# EAGLE design bq24616_battery_charger (EAGLE 9.5.2)
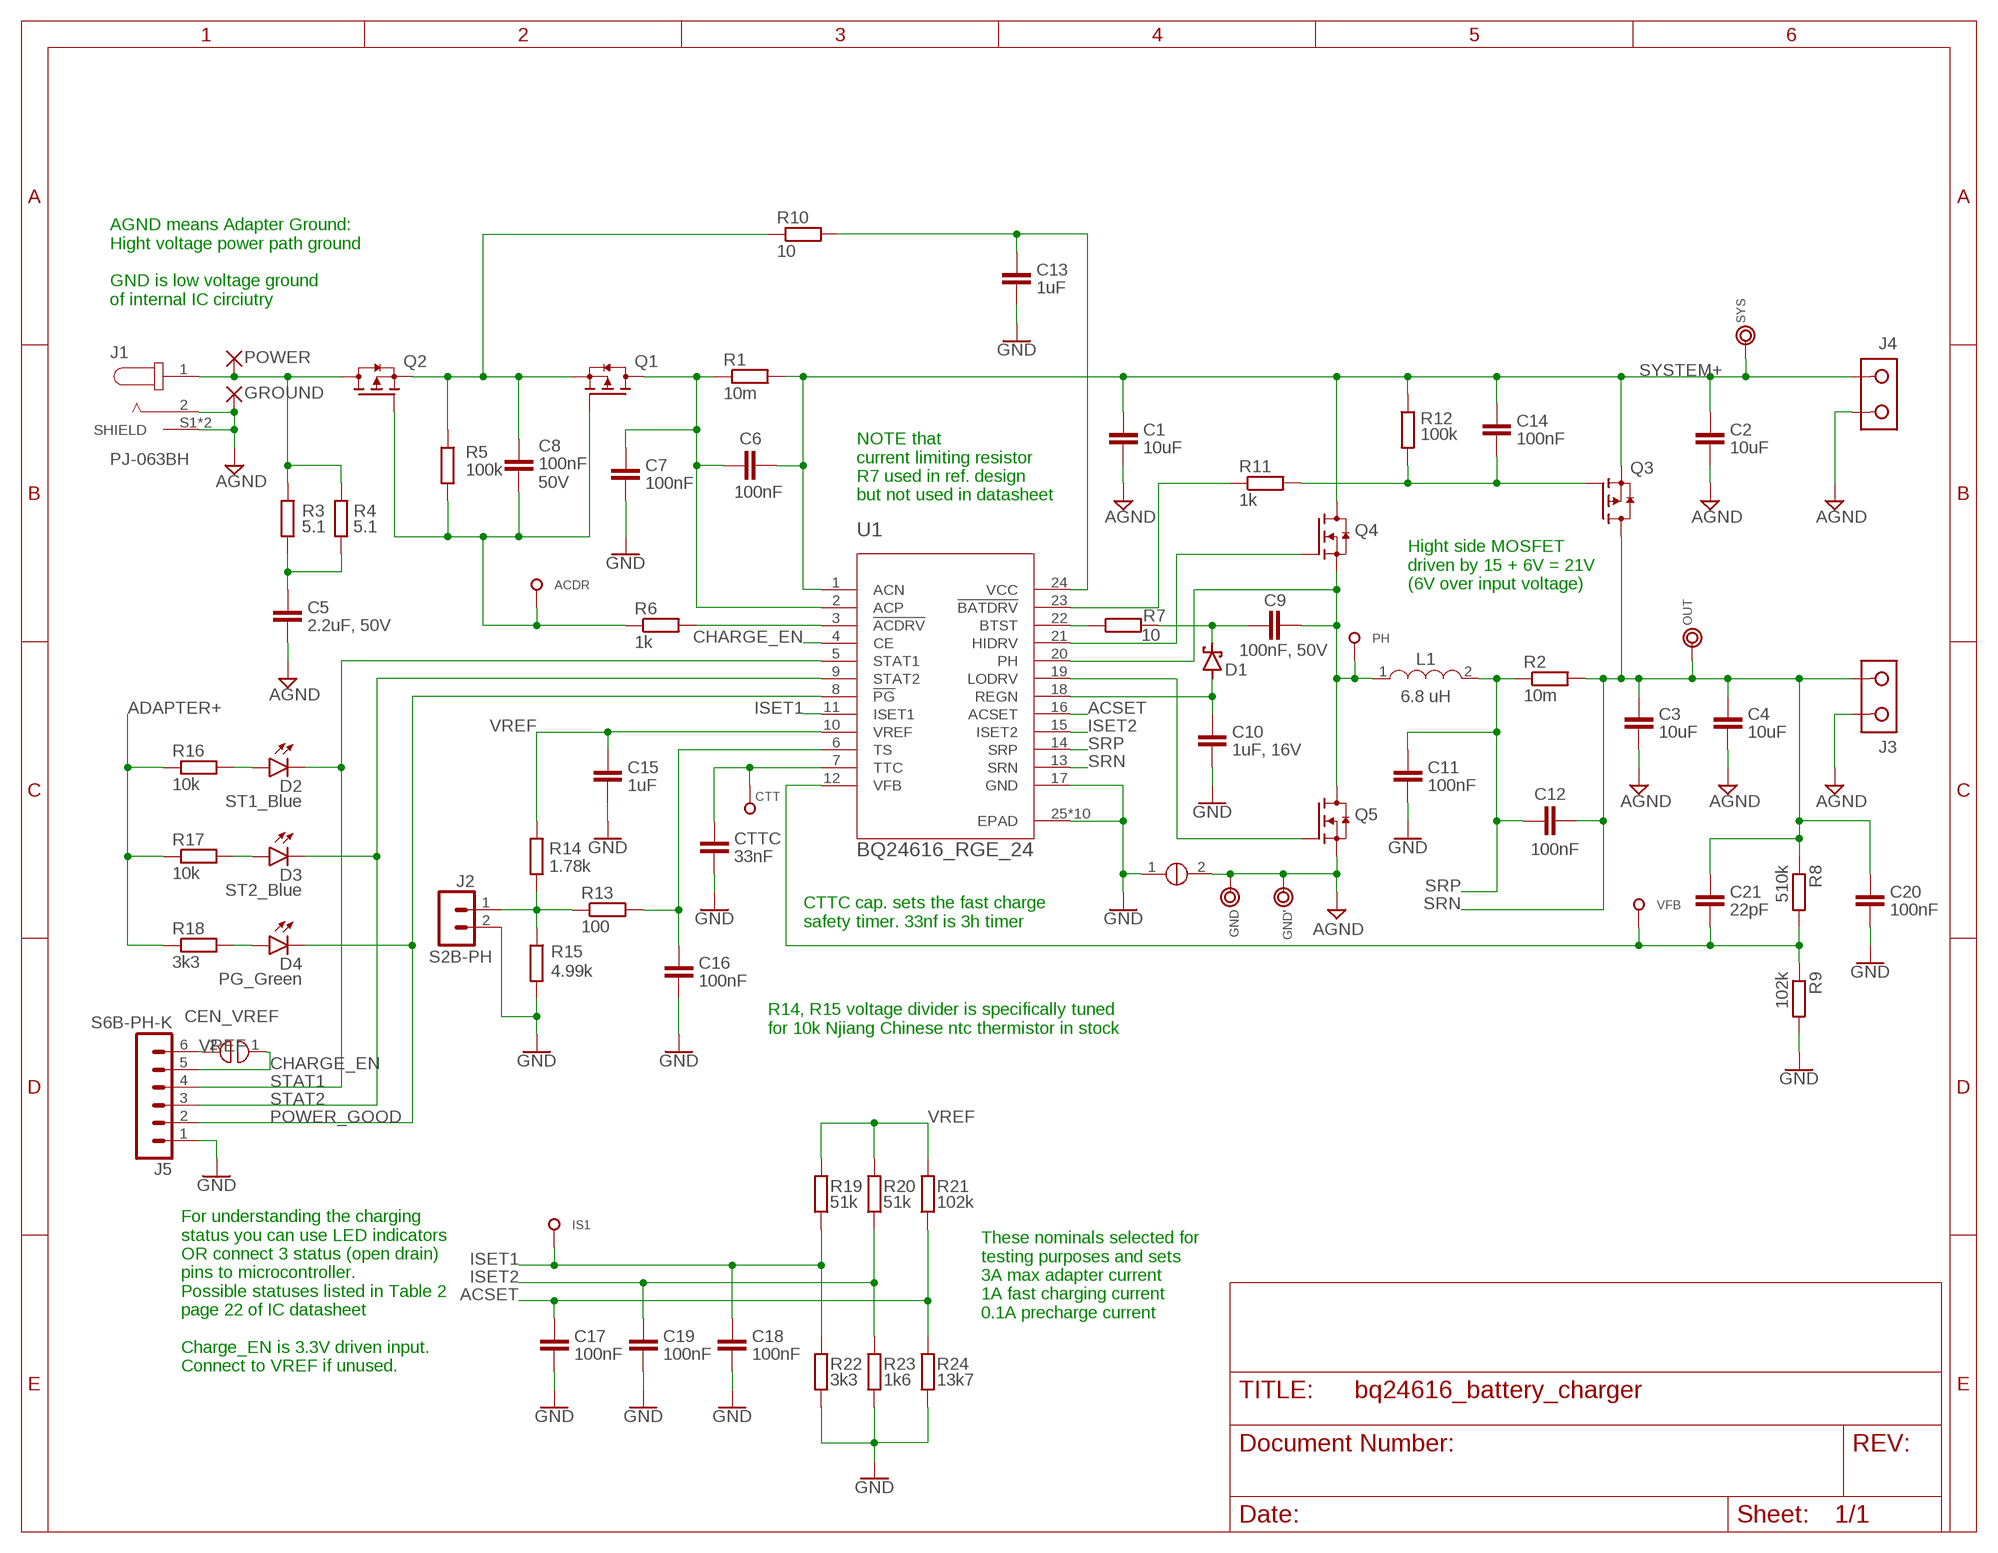
[diagram p0: schematic, sheet 1]

## Parts
ACDR  TEST_PAD-[1.27MM]  [TP1.27MM]
C1  10uF  C-EU-CERAMIC1206  [C1206]
C2  10uF  C-EU-CERAMIC1206  [C1206]
C3  10uF  C-EU-CERAMIC1206  [C1206]
C4  10uF  C-EU-CERAMIC1206  [C1206]
C5  2.2uF, 50V  C-EU-CERAMIC0805  [C0805]
C6  100nF  C-EU-CERAMIC0603  [C0603]
C7  100nF  C-EU-CERAMIC0603  [C0603]
C8  100nF  C-EU-CERAMIC0603  [C0603]
C9  100nF, 50V  C-EU-CERAMIC0603  [C0603]
C10  1uF, 16V  C-EU-CERAMIC0603  [C0603]
C11  100nF  C-EU-CERAMIC0603  [C0603]
C12  100nF  C-EU-CERAMIC0603  [C0603]
C13  1uF  C-EU-CERAMIC0603  [C0603]
C14  100nF  C-EU-CERAMIC0603  [C0603]
C15  1uF  C-EU-CERAMIC0603  [C0603]
C16  100nF  C-EU-CERAMIC0603  [C0603]
C17  100nF  C-EU-CERAMIC0603  [C0603]
C18  100nF  C-EU-CERAMIC0603  [C0603]
C19  100nF  C-EU-CERAMIC0603  [C0603]
C20  100nF  C-EU-CERAMIC0603  [C0603]
C21  22pF  C-EU-CERAMIC0603  [C0603]
CEN_VREF  SOLDER_BRIDGE  [SOLDER_BRIDGE]
CTT  TEST_PAD-[1.27MM]  [TP1.27MM]
CTTC  33nF  C-EU-CERAMIC0603  [C0603]
D1  SOD523-SCHOTTKY  [SOD523]
D2  ST1_Blue  LED0805  [LED-0805]
D3  ST2_Blue  LED0805  [LED-0805]
D4  PG_Green  LED0805  [LED-0805]
GND  TEST_RING  [TEST_RING]
GND'  TEST_RING  [TEST_RING]
GROUND  WIRE_TO_BOARD_2,54/1,1  [2,54/1,1]
IS1  TEST_PAD-[1.27MM]  [TP1.27MM]
J1  PJ-063BH  [CUI_PJ-063BH]
J2  S2B-PH  S2B-PH-K  [S2B-PH-K]
J3  DG301-2P"  [DG301-2P]
J4  DG301-2P"  [DG301-2P]
J5  S6B-PH-K  [S6B-PH-K]
L1  6.8 uH  MCS0630-100MN1  [SMD-0630]
OUT  TEST_RING  [TEST_RING]
PH  TEST_PAD-[1.27MM]  [TP1.27MM]
POWER  WIRE_TO_BOARD_2,54/1,1  [2,54/1,1]
Q1  SI7121DN-T1-GE3  [VISHAY_SI7121DN-T1-GE3]
Q2  SI7121DN-T1-GE3  [VISHAY_SI7121DN-T1-GE3]
Q3  SI7121DN-T1-GE3  [VISHAY_SI7121DN-T1-GE3]
Q4  SON5X6_MOSFET  [SON5X6]
Q5  SON5X6_MOSFET  [SON5X6]
R1  10m  R_EU_CS  [CS_R0805]
R2  10m  R_EU_CS  [CS_R0805]
R3  5.1  R-EU1206  [R1206]
R4  5.1  R-EU1206  [R1206]
R5  100k  R-EU0603  [R0603]
R6  1k  R-EU0603  [R0603]
R7  10  R-EU0603  [R0603]
R8  510k  R-EU0603  [R0603]
R9  102k  R-EU0603  [R0603]
R10  10  R-EU1206  [R1206]
R11  1k  R-EU0603  [R0603]
R12  100k  R-EU0603  [R0603]
R13  100  R-EU0603  [R0603]
R14  1.78k  R-EU0603  [R0603]
R15  4.99k  R-EU0603  [R0603]
R16  10k  R-EU0603  [R0603]
R17  10k  R-EU0603  [R0603]
R18  3k3  R-EU0603  [R0603]
R19  51k  R-EU0603  [R0603]
R20  51k  R-EU0603  [R0603]
R21  102k  R-EU0603  [R0603]
R22  3k3  R-EU0603  [R0603]
R23  1k6  R-EU0603  [R0603]
R24  13k7  R-EU0603  [R0603]
SB2  SHORT  [SHORT]
SYS  TEST_RING  [TEST_RING]
U1  BQ24616_RGE_24  [RGE24_2P45X2P45]
VFB  TEST_PAD-[1.27MM]  [TP1.27MM]

## Nets
ACDRV: R6.2 U1.3(!ACDRV)
ACP: C6.1 C7.1 Q1.5(D) Q1.6(D) Q1.7(D) Q1.8(D) Q1.9(D) R1.1 U1.2(ACP)
ACSET: C17.1 R21.1 R24.2 U1.16(ACSET)
ADAPTER+: J1.1 POWER.1(P) Q2.5(D) Q2.6(D) Q2.7(D) Q2.8(D) Q2.9(D) R3.2 R4.2 R16.1 R17.1 R18.1
AGND: C1.2 C2.2 C3.2 C4.2 C5.2 GND'.1 GND.1 GROUND.1(P) J1.2 J1.S1(SHIELD) J1.S2(SHIELD) J3.1 J4.2 Q5.1(S) Q5.2(S) Q5.3(S) SB2.2
BATDRV: R11.1 U1.23(!BATDRV)
BTST: R7.1 U1.22(BTST)
BTST1: C9.1 D1.C R7.2
CHARGE_EN: CEN_VREF.1 J5.5 U1.4(CE)
GATE: ACDR.1 C8.2 Q1.4(G) Q2.4(G) R5.2 R6.1
GND: C7.2 C10.2 C11.2 C13.2 C15.2 C16.2 C17.2 C18.2 C19.2 C20.2 CTTC.2 J2.2 J5.1 R9.2 R15.2 R22.1 R23.1 R24.1 SB2.1 U1.17(GND) U1.25(EPAD) U1.V(EPAD) U1.V_1(EPAD) U1.V_2(EPAD) U1.V_3(EPAD) U1.V_4(EPAD) U1.V_5(EPAD) U1.V_6(EPAD) U1.V_7(EPAD) U1.V_8(EPAD)
HIDRV: Q4.4(G) U1.21(HIDRV)
ISET1: C18.1 IS1.1 R19.1 R22.2 U1.11(ISET1)
ISET2: C19.1 R20.1 R23.2 U1.15(ISET2)
LODRV: Q5.4(G) U1.19(LODRV)
N$3: C5.1 R3.1 R4.1
N$17: C14.2 Q3.4(G) R11.2 R12.2
N$22: J2.1 R13.1 R14.2 R15.1
N$25: D2.+(A) R16.2
N$26: D3.+(A) R17.2
N$27: D4.+(A) R18.2
PH: C9.2 L1.1 PH.1 Q4.1(S) Q4.2(S) Q4.3(S) Q5.5(D) Q5.6(D) Q5.7(D) Q5.8(D) Q5.9(D) U1.20(PH)
POWER_GOOD: D4.-(C) J5.2 U1.8(!PG)
REGN: C10.1 D1.A U1.18(REGN)
SRN: C3.1 C4.1 C12.2 C20.1 C21.1 J3.2 OUT.1 Q3.5(D) Q3.6(D) Q3.7(D) Q3.8(D) Q3.9(D) R2.2 R8.1 U1.13(SRN)
SRP: C11.1 C12.1 L1.2 R2.1 U1.14(SRP)
STAT1: D2.-(C) J5.4 U1.5(STAT1)
STAT2: D3.-(C) J5.3 U1.9(STAT2)
SYSTEM+: C1.1 C2.1 C6.2 C14.1 J4.1 Q3.1(S) Q3.2(S) Q3.3(S) Q4.5(D) Q4.6(D) Q4.7(D) Q4.8(D) Q4.9(D) R1.2 R12.1 SYS.1 U1.1(ACN)
TCC: CTT.1 CTTC.1 U1.7(TTC)
TS: C16.1 R13.2 U1.6(TS)
VCC: C13.1 R10.2 U1.24(VCC)
VCC1: C8.1 Q1.1(S) Q1.2(S) Q1.3(S) Q2.1(S) Q2.2(S) Q2.3(S) R5.1 R10.1
VFB: C21.2 R8.2 R9.1 U1.12(VFB) VFB.1
VREF: C15.1 CEN_VREF.2 J5.6 R14.1 R19.2 R20.2 R21.2 U1.10(VREF)

## Notes on the sheet
- AGND means Adapter Ground:
  Hight voltage power path ground
  
  GND is low voltage ground
  of internal IC circiutry
- 50V
- NOTE that 
  current limiting resistor
  R7 used in ref. design
  but not used in datasheet
- Hight side MOSFET
  driven by 15 + 6V = 21V
  (6V over input voltage)
- CTTC cap. sets the fast charge
  safety timer. 33nf is 3h timer
- R14, R15 voltage divider is specifically tuned
  for 10k Njiang Chinese ntc thermistor in stock
- These nominals selected for
  testing purposes and sets
  3A max adapter current
  1A fast charging current
  0.1A precharge current
- For understanding the charging
  status you can use LED indicators
  OR connect 3 status (open drain)
  pins to microcontroller.
  Possible statuses listed in Table 2
  page 22 of IC datasheet
  
  Charge_EN is 3.3V driven input.
  Connect to VREF if unused.

## Library data of the parts
ACDR CTT IS1 PH VFB = testing:TEST_PAD: Test point SMD Updated: 05.11.19 by Andrey Dovnar, andrevdovnar@gmail.com
C1-C21 CTTC = Capacitors:C-EU-CERAMIC
CEN_VREF = testing:SOLDER_BRIDGE
D1 = Semiconductor_devices:SOD523-SCHOTTKY
D2-D4 = Semiconductor_devices:LED0805: LED Model suitable for all 0805 leds Updated: 22.10.19 by Andrey Dovnar, andrevdovnar@gmail.com
GND GND' OUT SYS = testing:TEST_RING: Test rings are used to fixing multimeter probe and doing measurements hands-free Updated: 02.01.2020 by Denis Yaskevich, denis.jaskevich@yandex.by
GROUND POWER = commonly used connectors:WIRE_TO_BOARD_2,54/1,1: THROUGH-HOLE PAD
J1 = commonly used connectors:PJ-063BH: 2.5 mm Center Pin, 8.0 A, Right Angle, Through Hole, Shielded, Kinked Pins, Dc Power Jack Connector; MANUFACTURER: CUI INC; PARTREV: 1.02; STANDARD: Manufacturer recommendations
J2 = con-jst-ph:S2B-PH-K: Wire to board connector Model suitable for S2B-PH-K Updated: 21.10.19 by Andrey Dovnar, andrevdovnar@gmail.com
J3 J4 = Terminal blocks:DG301-2P
J5 = con-jst-ph:S6B-PH-K: Wire to board connector Model suitable for S6B-PH-K Updated: 21.10.19 by Andrey Dovnar, andrevdovnar@gmail.com
L1 = Inductors:MCS0630-100MN1: Inductors (SMD) 0630,SMD,7.3x6.6mm RoHS Source: Datasheet <https://datasheet.lcsc.com/szlcsc/1912111437_PSA-Prosperity-Dielectrics-MCS0630-100MN1_C385254.pdf>
Q1-Q3 = Transistors:SI7121DN-T1-GE3: P Channel 30V 0.018 Ohm 52 W Surface Mount Power Mosfet - PowerPAK-1212-8; DESCRIPTION: P-Channel 30V 16A _Tc_ Surface Mount PowerPAK® 1212-8; LCSC_PART_NUMBER: C190356; LCSC_PURCHASE_URL: https://lcsc.com/product-detail/MOSFET_Vishay-Intertech_SI7121DN-T1-GE3_Vishay-Intertech-SI7121DN-T1-GE3_C190356.html; MF: Vishay Siliconix; MPN: SI7121DN-T1-GE3; PACKAGE: PowerPAK®-1212-8 Vishay
Q4 Q5 = Transistors:SON5X6_MOSFET: Suitable for TI csd185**Q5A MOSFETs; BUILT_BY: EMA_UL_Team; MANUFACTURER_PART_NUMBER: CSD18534Q5A; VENDOR: Texas Instruments
R1 R2 = Resistors:R_EU_CS
R3-R24 = Resistors:R-EU
SB2 = testing:SHORT
U1 = Impulse dc-dc:BQ24616_RGE_24: JEITA Compatible Stand-Alone Synchronous Switch-Mode Li-Ion or Li-Polymer Battery Charger; DATASHEET_URL: http://www.ti.com/lit/gpn/BQ24616; DESCRIPTION: JEITA Compatible Stand-Alone Synchronous Switch-Mode Li-Ion or Li-Polymer Battery Charger; FAMILY_NAME: BATTERY CHARGE MANAGEMENT; GENERIC_PART_NUMBER: BQ24616; INDUSTRY_STD_PKG_TYPE: VQFN; MANUFACTURER: Texas Instruments; PACKAGE_DESIGNATOR: RGE; PIN_COUNT: 24

## Board
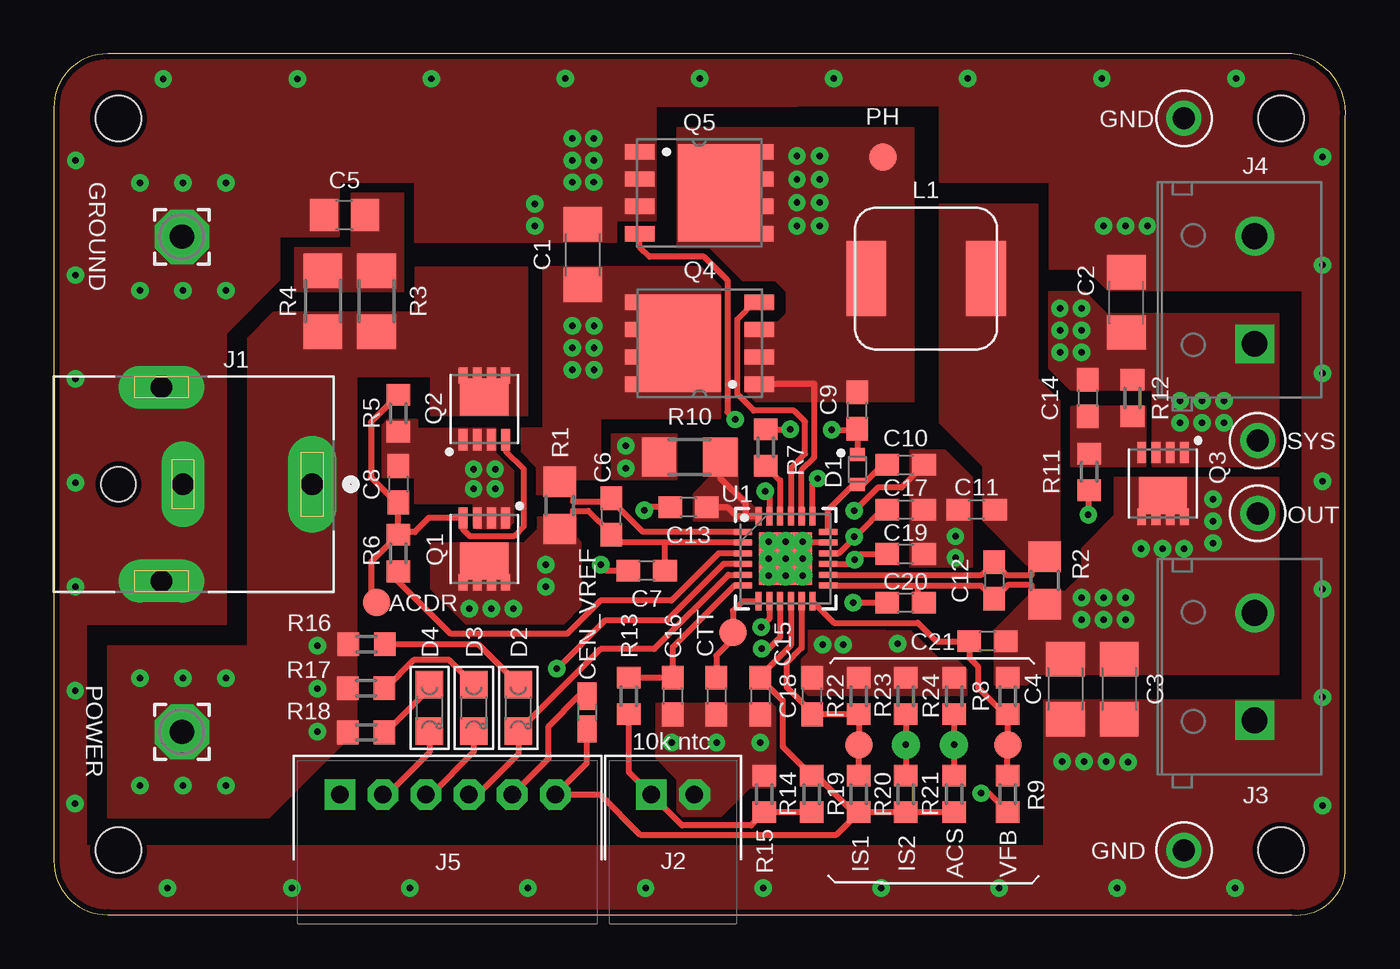
[diagram p1: board, top side]
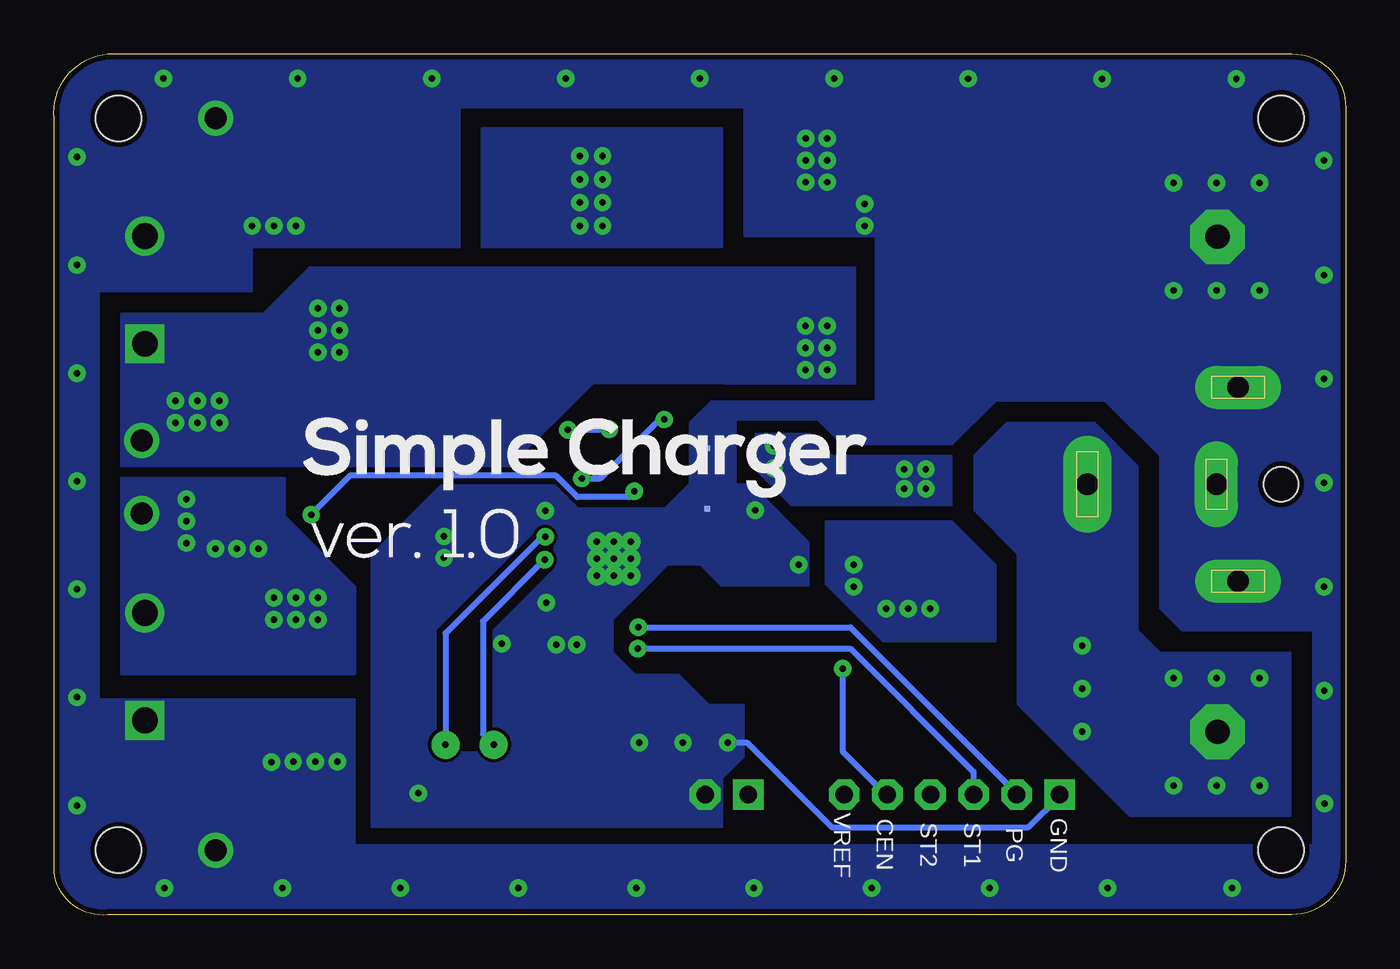
[diagram p2: board, bottom side, seen from below]

Size 60.01 x 40.01 mm. Coordinates in mm from the lower left corner, seen from the top.
Outline: 0,37.51 0,2.51 arc90 2.5,0.01 57.5,0.01 arc90 60,2.01 60,37.01 arc90 57.5,40.01 2.5,40.01 arc90 0,37.51
Copper layers (1*16): Top 0.035mm / dielectric 0.11mm / Bottom 0.035mm
Design rules "Design_rules_charger *": minimum track width 6mil, minimum drill 0.3mm, track to track 6mil, track to pad 6mil, pad to pad 6mil, via to via 6mil, smd to smd 6mil, copper to edge 10mil, drill to drill 8mil, minimum pad ring 12mil, minimum via ring 10mil, stop-mask expansion 3mil, vias tented up to drill 25mil, thermal gap 10mil
Holes 2.1 mm at 3,37.01 3,3.01 57,37.01 57,3.01

### Footprints (pad centres in the part's own frame; a part is rotated, then mirrored left to right if it is on the bottom)
TP1.27MM = smd 1.27 x 1.27: 1 0,0
C1206 = smd 1.6 x 1.8: 1 -1.4,0; 2 1.4,0
C0805 = smd 1.3 x 1.5: 1 -0.95,0; 2 0.95,0
C0603 = smd 1.1 x 1: 1 -0.85,0; 2 0.85,0
SOLDER_BRIDGE = smd 1.27 x 0.889: 1 -0.762,0; 2 0.762,0
SOD523 = smd 0.6 x 0.7: A 0.7,0; C -0.7,0
LED-0805 = smd 1.27 x 1.27: + -1.079,0; - 1.079,0
TEST_RING = drill 1.02 pad 1.6: 1 0,0
2,54/1,1 = drill 1.118 pad 2.54 octagon: 1 0,0
CUI_PJ-063BH = drill 1 pad 2.25 long: 1 0,0 | drill 1 pad 2 long: 2 6,0; S1 7,4.5; S2 7,-4.5 | hole 1.6: 9,0
S2B-PH-K = drill 0.813 square: 1 -1,0 | drill 0.813 octagon: 2 1,0
DG301-2P = drill 1.2 square: 1 -2.5,0 | drill 1.2: 2 2.5,0
S6B-PH-K = drill 0.813 square: 1 -5,0 | drill 0.813 octagon: 2 -3,0; 3 -1,0; 4 1,0; 5 3,0; 6 5,0
SMD-0630 = smd 1.85 x 3.5: 1 -2.775,0; 2 2.775,0
VISHAY_SI7121DN-T1-GE3 = smd 0.991 x 0.406: 1 -1.435,0.99; 2 -1.435,0.33; 3 -1.435,-0.33; 4 -1.435,-0.99 | smd 0.762 x 0.406: 5 1.55,-0.99; 6 1.55,-0.33; 7 1.55,0.33; 8 1.55,0.99 | smd 1.727 x 2.235: 9 0.557,0
SON5X6 = smd 1.372 x 0.71: 1 -2.77,1.905; 2 -2.77,0.635; 3 -2.77,-0.635; 4 -2.77,-1.905 | smd 1.18 x 0.71: 5 2.866,-1.905; 6 2.866,-0.635; 7 2.866,0.635; 8 2.866,1.905 | smd 3.85 x 4.52: 9 0.941,0
CS_R0805 = smd 1.4 x 1.5: 1 -1.1,0; 2 1.1,0
R1206 = smd 1.6 x 1.803: 1 -1.422,0; 2 1.422,0
R0603 = smd 1 x 1.1: 1 -0.85,0; 2 0.85,0
SHORT = smd 0.254 x 0.254: 1 -1.397,0; 2 1.397,0
RGE24_2P45X2P45 = smd 0.85 x 0.28: 1 -1.975,1.25; 2 -1.975,0.75; 3 -1.975,0.25; 4 -1.975,-0.25; 5 -1.975,-0.75; 6 -1.975,-1.25; 13 1.975,-1.25; 14 1.975,-0.75; 15 1.975,-0.25; 16 1.975,0.25; 17 1.975,0.75; 18 1.975,1.25 | smd 0.28 x 0.85: 7 -1.25,-1.975; 8 -0.75,-1.975; 9 -0.25,-1.975; 10 0.25,-1.975; 11 0.75,-1.975; 12 1.25,-1.975; 19 1.25,1.975; 20 0.75,1.975; 21 0.25,1.975; 22 -0.25,1.975; 23 -0.75,1.975; 24 -1.25,1.975 | smd 2.45 x 2.45: 25 0,0 | drill 0.3 pad 0.508: V -0.787,-0.787; V_1 -0.787,0; V_2 -0.787,0.787; V_3 0,-0.787; V_4 0,0; V_5 0,0.787; V_6 0.787,-0.787; V_7 0.787,0; V_8 0.787,0.787

### Placement (x,y rotation side)
ACDR  15,14.53 0 top
C1  24.58,30.68 90 top
C2  49.82,28.46 90 top
C3  49.48,10.5 270 top
C4  46.98,10.5 270 top
C5  13.5,32.51 180 top
C6  25.9,18.52 90 top
C7  27.54,16 180 top
C8  16,20.01 270 top
C9  37.33,23.44 90 top
C10  39.57,20.91 0 top
C11  42.86,18.84 180 top
C12  43.67,15.55 270 top
C13  29.48,18.95 180 top
C14  48.02,24.02 270 top
C15  32.81,10.17 270 top
C16  28.74,10.17 270 top
C17  39.57,18.84 0 top
C18  35.24,10.17 90 top
C19  39.57,16.78 0 top
C20  39.57,14.5 180 top
C21  43.37,12.73 180 top
CEN_VREF  24.77,9.41 270 top
CTT  31.55,13.13 0 top
CTTC  30.78,10.17 270 top
D1  37.33,20.7 270 top
D2  21.58,9.63 270 top
D3  19.51,9.63 270 top
D4  17.45,9.63 270 top
GND  52.5,3.01 0 top
GND'  52.5,37.01 0 top
GROUND  5.95,31.51 0 top
IS1  37.39,7.91 0 top
J1  12,20.01 180 top
J2  28.76,5.59 0 top
J3  55.78,11.54 90 top
J4  55.78,29.04 90 top
J5  18.29,5.59 0 top
L1  40.52,29.57 0 top
OUT  55.92,18.67 0 top
PH  38.51,35.22 0 top
POWER  5.95,8.51 0 top
Q1  20,17.01 270 top
Q2  20,23.51 90 top
Q3  51.52,20.05 270 top
Q4  30,26.56 180 top
Q5  29.98,33.55 0 top
R1  23.5,19.03 90 top
R2  46.02,15.55 270 top
R3  15,28.51 270 top
R4  12.5,28.51 270 top
R5  16,23.31 90 top
R6  16,16.81 270 top
R7  33.07,21.72 90 top
R8  44.3,10.17 270 top
R9  44.3,5.63 270 top
R10  29.53,21.28 0 top
R11  48.09,20.59 90 top
R12  50.1,24.02 270 top
R13  26.71,10.17 90 top
R14  35.21,5.63 270 top
R15  33,5.63 90 top
R16  14.53,12.59 0 top
R17  14.51,10.54 0 top
R18  14.51,8.49 0 top
R19  37.39,5.63 270 top
R20  39.57,5.63 270 top
R21  41.83,5.63 270 top
R22  37.39,10.17 270 top
R23  39.57,10.17 270 top
R24  41.83,10.17 270 top
SB2  29.67,20.28 90 bottom
SYS  55.92,22.05 0 top
U1  33.99,16.55 0 top
VFB  44.33,7.91 0 top

### Tracks (layer width: path | path; a pad name or v marks a point on that pad's centre or on a via)
ACDRV
  Top 0.279: U1.3 30.88,16.8 28.69,14.61 25.39,14.61 23.85,13.07 18.44,13.07 16,15.51 R6.2
ACP  (via drill 0.3)
  Top 0.279: R1.1 23.65,17.93 24.1,18.38 24.1,18.78 24.84,18.78 25.9,17.72 C6.1 26.27,17.3 28.39,17.3 | C7.1 28.39,17.3 | U1.2 28.39,17.3
  other vias: 19.3,14.24 20.32,14.24 21.34,14.24 22.86,15.25 22.86,16.27
  pour Top (no thermals): 24.5,17.31 24.5,14.35 23.67,13.52 19.16,13.52 17.5,15.18 17.5,17.31 21.84,17.29 22.48,17.92 22.48,18.5 24.26,18.5 24.25,17.56
  pour Bottom (no thermals): 18.29,18.3 24.16,18.3 24.16,15.38 21.49,12.71 16.26,12.71 16.26,16.27
ACSET  (via drill 0.3, 0.3 pad 1.3)
  Top 0.279: U1.16 36.47,16.8 37.19,17.52 v37.19,17.57 37.24,17.57 37.47,17.8 38.5,18.84 C17.1 | R21.1 41.83,8.14 | 41.83,8.14 R24.2 | 41.83,8.14 41.82,8.13 v41.82,7.91
  Bottom 0.279: v41.82,7.91 41.82,13.09 37.33,17.57 v37.19,17.57
ADAPTER+  (via drill 0.3)
  other vias: 4,11.01 6,11.01 8,11.01 4,6.01 6,6.01 8,6.01 12.25,12.51 12.25,10.51 12.25,8.51
  pour Top (no thermals): 2.5,12.51 9,12.51 9,26.79 10.22,28.01 16.77,28.01 16.77,30.1 22,30.1 22,23.22 17.5,23.22 17.5,25.01 14.08,25.01 14.08,8.61 9.98,4.51 2.5,4.51
  pour Bottom (no thermals): 2.54,12.21 2.54,4.59 10.03,4.59 15.24,9.79 15.24,16.78 17.27,18.81 17.27,21.35 15.75,22.87 11.68,22.87 9.65,20.84 9.65,13.22 8.64,12.21
AGND  (via drill 0.3)
  other vias: 46.84,7.13 47.87,7.13 48.89,7.13 58.93,10.11 58.93,5.09 54.86,1.26 49.39,1.26 43.91,1.26 38.44,1.26 32.96,1.26 27.49,1.26 22.01,1.26 16.54,1.26 11.06,1.26 5.28,1.26 0.99,5.17 0.99,10.43 1,15.25 1,20.08 1.01,24.91 1.01,29.73 1.02,35.07 5.08,38.85 11.31,38.85 17.54,38.86 23.77,38.86 30,38.86 36.23,38.87 42.46,38.87 48.69,38.87 54.91,38.88 58.93,35.22 58.93,30.2 58.93,25.18 58.93,20.16 58.93,15.13 25.09,34.05 25.09,35.07 25.09,36.08 24.08,36.08 24.08,35.07 24.08,34.05 22.35,32.02 22.35,33.03 48.77,32.02 49.78,32.02 50.8,32.02 4,34.01 6,34.01 8,34.01 4,29.01 6,29.01 8,29.01 49.9,7.11
  pour Top (no thermals): 0,13.51 8,13.51 8,27.01 10.5,29.51 10.5,31.51 13.25,31.51 13.25,34.05 16.76,34.05 16.76,31.26 26.14,31.26 26.14,32.25 27.98,32.25 27.98,37.55 41.15,37.61 41.15,34.05 46.25,34.05 46.25,30.01 47.99,30.01 48.99,29.01 60,29.01 60,40.01 0,40.01
  pour Top (no thermals): 1.5,14.01 1.5,3.21 45.99,3.21 45.99,9.99 57.99,9.99 57.99,35.51 60,35.51 60,0.01 0,0.01 0,14.01
  pour Bottom (no thermals): 8.13,25.41 8.13,27.45 18.19,37.5 41.15,37.5 41.15,31 50.8,31 50.8,28.97 57.91,28.97 57.91,10.05 46,10.05 46,3.27 1.52,3.27 1.52,13.22 7.62,13.22 8.64,14.24 8.64,22.37 0,22.37 0,0.52 0.51,0.01 59.94,0.01 59.94,40.15 0,40.15 0,25.41
  pour Bottom (no thermals): 0,21.35 8.64,21.35 11.18,23.89 16.26,23.89 18.29,21.86 23.37,21.86 24.51,23 28.32,23 28.32,20.05 30.48,20.05 30.48,22.87 29.46,23.89 21.84,23.89 21.84,31.51 27.94,31.51 27.94,39.64 19.76,39.58 6.1,25.92 0,25.92
BATDRV  (via drill 0.3)
  Top 0.279: U1.23 33.24,19.5 v33.05,19.69 | R11.1 48.06,19.71 v48.06,18.61
  Bottom 0.279: v33.05,19.69 33.31,19.42 35.69,19.42 36.68,20.41 46.25,20.41 v48.06,18.61
BTST
  Top 0.279: R7.1 33.74,20.2 U1.22
BTST1  (via drill 0.3)
  Top 0.279: R7.2 v34.2,22.57 | v36.14,22.54 37.28,22.54 C9.1 D1.C
  Bottom 0.279: v36.14,22.54 36.12,22.57 v34.2,22.57
CHARGE_EN  (via drill 0.3)
  Top 0.279: v23.37,11.44 | v23.37,11.44 25.6,13.68 28.48,13.68 31.11,16.31 U1.4 | J5.5 22.99,7.29 22.99,8.78 24.38,10.17 CEN_VREF.1
  Bottom 0.279: v23.37,11.44 23.37,7.6 21.36,5.59 J5.5
GATE
  Top 0.279: R6.1 C8.2 15.9,19.16 14.73,20.33 14.73,22.9 R5.2 | Q1.4 17.42,18.45 16.76,17.79 16.13,17.79 R6.1 | Q1.4 | Q1.4 19.01,17.92 19.31,17.62 21.4,17.62 21.84,18.07 21.84,20.72 20.99,21.57 Q2.4 | R6.1 14.73,16.4 14.73,14.8 ACDR.1
GND  (via drill 0.3)
  Top 0.279: C13.2 27.58,18.95 v27.43,18.81 | C7.2 25.67,16 v25.4,16.27 | U1.17 34.78,17.3 U1.V_8 | R9.2 43.43,5.66 v43.08,5.66 | C20.2 v37.13,14.5 | C10.2 39.36,19.86 38.27,19.86 37.2,18.78 v37.19,18.78
  Bottom 0.279: v28.7,8.01 27.81,8.01 23.88,4.08 14.73,4.08 13.29,5.52 J5.1
  other vias: 30.78,8.01 32.82,8.01 35.71,12.56 36.67,12.56 41.88,17.59 41.88,16.6 39.2,12.61
  pour Bottom (no thermals): 35.73,15.29 32.51,15.25 31.5,16.27 29.98,16.27 28.99,15.28 24.92,15.28 24.92,17.32 27.64,20.03 30.5,20.03 31.61,18.92 35.73,18.92
  pour Top (no thermals): 27.97,9.84 27.97,7.3 28.96,6.31 28.96,4.59 30.99,4.59 32.31,5.91 33.53,5.91 33.53,9.64 33.32,9.84
  pour Top (no thermals): 34.72,11.88 34.72,10.53 35.05,10.2 42.42,10.2 42.42,11.4 42,11.81 41.2,11.81 40.1,12.91 39.8,13.21 38.64,13.22 35.05,13.22 35.05,12.21
  pour Bottom (no thermals): 28.96,4.08 28.96,6.36 27.94,7.38 27.94,9.79 29.59,9.79 30.99,11.19 33.02,11.19 34.04,12.21 34.04,13.73 32.51,15.25 32.51,17.27 35.56,17.27 39.61,13.22 39.61,6.4 37.28,4.08
  pour Top (no thermals): 39.78,21.6 39.78,16.17 42.67,16.17 42.67,20.33 41.4,21.6
  pour Bottom (no thermals): 34.04,17.79 34.57,17.79 36.75,19.98 42.01,19.98 45.26,16.73 45.26,4.08 37.08,4.08 37.08,7.58 42.25,7.58 42.25,13.26 37.59,17.92 36.78,17.92 36.78,16.24 35.79,15.25 35.05,15.25 34.04,16.27
HIDRV
  Top 0.279: Q4.4 32.54,28.47 31.75,27.68 31.75,24.2 32.51,23.43 34.39,23.43 34.9,22.92 34.9,21.44 34.23,20.78 U1.21
ISET1
  Top 0.279: U1.11 34.74,12.4 34.04,11.7 34.04,10.59 35.24,9.38 C18.1 R22.2 IS1.1 | R19.1 IS1.1 | IS1.1
ISET2  (via drill 0.3, 0.3 pad 1.3)
  Top 0.279: U1.15 37,16.3 v37.21,16.51 37.48,16.78 C19.1 | R20.1 v39.57,7.91 R23.2 | R20.1
  Bottom 0.279: v37.21,16.51 40.07,13.65 40.07,8.41 v39.57,7.91
LODRV  (via drill 0.3)
  Top 0.279: v31.65,23.02 31.29,23.38 31.29,29.5 30.21,30.58 27.67,30.58 27.21,31.04 Q5.4 | v35.48,20.28 35.24,20.04 U1.19
  Bottom 0.279: v35.48,20.28 34.62,20.28 31.88,23.02 v31.65,23.02
N$3
  pour Top (no thermals): 11.18,28.97 16.26,28.97 16.26,33.54 13.82,33.54 13.82,31 11.18,31
N$17
  pour Top (no thermals): 47.24,23.64 47.24,20.84 50.72,20.84 50.72,23.64
N$22
  Top 0.279: R14.2 R15.1 32.39,4.17 29.18,4.17 J2.1 26.71,6.64 R13.1
N$25
  Top 0.279: R16.2 19.7,12.59 D2.+
N$26
  Top 0.279: D3.+ 18.36,11.85 16.72,11.85 15.41,10.54 R17.2
N$27
  Top 0.279: R18.2 15.41,8.49 17.45,10.53 D4.+
PH  (via drill 0.3)
  Top 0.279: U1.20 34.74,20.67 35.33,21.26 35.33,24.68 32.79,24.68 Q4.1
  other vias: 34.52,35.27 34.52,33.1 34.52,32.02 35.57,32.02 35.57,33.1 35.57,35.27 34.52,34.18 35.57,34.18
  pour Top (no thermals): 28.96,36.59 28.96,31 30.48,31 32,29.48 33.53,29.48 34.04,28.97 34.04,27.95 33.63,27.55 32.11,27.55 32.11,24.37 32.61,23.86 39.95,23.86 39.95,36.59
  pour Bottom: 28.96,36.59 28.96,31 39.62,31 40.13,31 40.13,36.59
POWER_GOOD  (via drill 0.3)
  Top 0.279: U1.8 33.24,13.75 v32.87,13.37 | D4.- 17.45,7.56 15.48,5.59 J5.2
  Bottom 0.279: v32.87,13.37 23,13.37 15.29,5.66 J5.2
REGN
  Top 0.279: C10.1 38.49,20.91 37.58,20 D1.A 37.15,20 35.97,18.82 U1.18
SRN  (via drill 0.3)
  Top 0.279: R2.2 45.41,15.06 45.41,15.33 44.31,15.33 C12.2 43.07,15.3 40.15,15.3 | U1.13 40.15,15.3 | C20.1 40.15,14.77 40.15,15.3
  other vias: 53.85,19.32 53.85,18.3 53.85,17.29 47.75,13.73 48.77,13.73 49.78,13.73 50.5,17.01 51.5,17.01 52.5,17.01 47.75,14.75 48.77,14.75 49.78,14.75
  pour Bottom (no thermals): 49.28,20.33 49.28,18.53 46,15.25 46,11.19 56.9,11.19 56.9,20.33
  pour Top (no thermals): 56.9,11.19 45.72,11.19 45.21,10.68 43.69,10.68 43.69,13.22 45.49,15.02 46.99,15.02 47.75,15.78 47.75,17.03 49.28,18.56 49.28,20.33 56.9,20.33
SRP
  Top 0.279: R2.1 45.41,16.04 45.41,15.79 44.28,15.79 C12.1 43.08,15.8 U1.14
  pour Top (no thermals): 41.15,33.03 45.72,33.03 45.72,24.91 46.74,23.89 46.74,16.27 45.21,16.27 43.15,18.33 43.15,20.87 41.15,22.87
STAT1
  Top 0.279: U1.5 31.34,15.8 27.89,12.36 25.4,12.36 21.59,8.55 D2.- 21.58,7.5 19.67,5.59 J5.4
STAT2  (via drill 0.3)
  Top 0.279: v32.89,12.38 33.22,12.38 33.74,12.9 U1.9 | D3.- 19.51,7.58 17.52,5.59 J5.3
  Bottom 0.279: v32.89,12.38 23.01,12.38 17.29,6.66 J5.3
SYSTEM+  (via drill 0.3)
  Top 0.279: U1.1 27.37,17.8 25.9,19.27 C6.2 25.74,19.22 24.11,19.22 24.11,19.52 R1.2
  other vias: 25.1,27.37 25.1,26.35 25.1,25.34 24.08,25.34 24.08,26.35 24.08,27.37 46.74,28.18 46.74,27.17 46.74,26.15 47.75,26.15 47.75,27.17 47.75,28.18 52.32,22.87 53.34,22.87 54.36,22.87 54.36,23.89 53.34,23.89 52.32,23.89
  pour Top (no thermals): 22.42,19.53 22.42,20.82 21.72,21.53 21.72,22.62 22.73,22.62 22.74,30.11 22.75,30.13 30.03,30.13 30.97,29.19 30.97,23.06 25.4,23.06 25.4,23.06 25.4,20.23 24.24,20.23 24.23,19.53
  pour Bottom (no thermals): 22.78,30.11 22.78,24.65 34.96,24.7 38.83,20.84 56.9,20.84 56.9,27.95 50.29,27.95 48.13,30.11
  pour Top (no thermals): 46.23,28.97 46.23,25.41 47.24,24.4 51.03,24.4 51.03,20.84 56.9,20.84 56.9,27.95 48.9,27.95 47.88,28.97
TCC
  Top 0.279: U1.7 31.98,14.58 31.55,14.15 CTT.1 31.55,12.83 30.78,12.06 CTTC.1
TS
  Top 0.279: U1.6 31.61,15.3 28.74,12.44 C16.1 R13.2
VCC
  Top 0.279: U1.24 32.13,18.53 | 32.13,18.53 31.73,18.53 31.3,18.95 C13.1 | R10.2 30.96,20.31 32.13,19.14 32.13,18.53
  pour Top (no thermals): 31.78,22.11 30.61,22.11 30.61,20.46 29.72,19.57 29.72,18.3 32.89,18.3 32.89,18.94 32.54,18.94 31.78,19.7
VCC1  (via drill 0.3)
  other vias: 19.5,20.71 20.5,20.71 20.5,19.81 19.5,19.81 26.57,21.81 26.57,20.77
  pour Top (no thermals): 15.24,20.33 15.24,22.75 15.5,23.01 16.9,23.01 16.9,22.61 20.52,22.62 20.52,21.48 21.36,20.64 21.36,18.25 21.08,17.97 19.63,17.97 19.48,18.12 19.48,19.11 16.79,19.11 16.76,19.14 16.76,20.33
  pour Bottom: 18.29,19.04 18.29,21.35 23.88,21.35 24.89,22.37 27.43,22.37 27.43,20.73 25.74,19.04
  pour Top (no thermals): 25.91,22.34 25.91,20.23 28.96,20.23 28.96,22.34
VFB
  Top 0.279: U1.12 36.24,13.58 40.13,13.58 41,12.71 C21.2 42.52,11.95 42.93,11.54 42.93,10.57 44.18,9.32 R8.2 44.3,7.93 VFB.1 44.3,7.89 R9.1
VREF
  Top 0.279: U1.10 34.24,12.53 32.71,10.99 32.74,11.02 C15.1 33.86,9.98 33.86,7.83 R14.1 35.25,6.51 35.4,6.51 37.13,4.78 R19.2 | R19.2 R20.2 R21.2 | R19.2 36.35,3.74 27.23,3.74 25.4,5.57 23.3,5.57 J5.6 24.77,7.07 CEN_VREF.2

### Text on the board
tPlace: 10k ntc | IS2 | ACS
tNames: C:/Users/User/Desktop/123.bmp
bNames: GND | PG | ST1 | ST2 | CEN | VREF